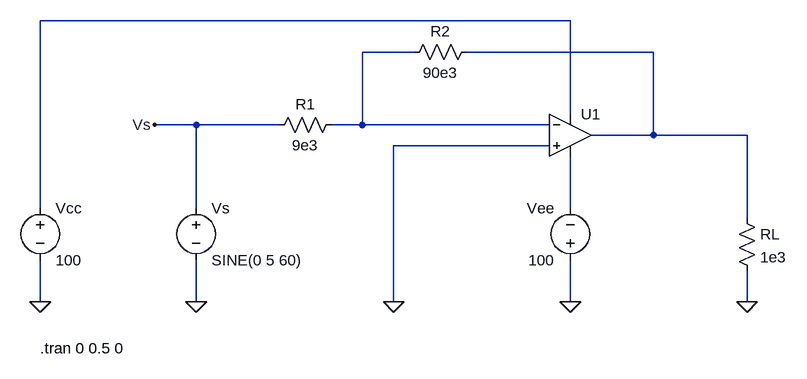
[diagram p0: schematic exercise1.asc]
exercise1.asc, the LTspice schematic file:
Version 4
SHEET 1 1124 680
WIRE 784 -96 -32 -96
WIRE 544 -48 464 -48
WIRE 912 -48 624 -48
WIRE 784 48 784 -96
WIRE 208 64 144 64
WIRE 336 64 208 64
WIRE 464 64 464 -48
WIRE 464 64 416 64
WIRE 752 64 464 64
WIRE 912 80 912 -48
WIRE 912 80 816 80
WIRE 1056 80 912 80
WIRE 752 96 512 96
WIRE -32 192 -32 -96
WIRE 208 192 208 64
WIRE 784 192 784 112
WIRE 1056 208 1056 80
WIRE -32 336 -32 272
WIRE 208 336 208 272
WIRE 512 336 512 96
WIRE 784 336 784 272
WIRE 1056 336 1056 288
FLAG -32 336 0
FLAG 208 336 0
FLAG 784 336 0
FLAG 512 336 0
FLAG 144 64 Vs
FLAG 1056 336 0
SYMBOL voltage 208 176 R0
WINDOW 123 0 0 Left 0
WINDOW 39 0 0 Left 0
SYMATTR InstName Vs
SYMATTR Value SINE(0 5 60)
SYMBOL res 432 48 R90
WINDOW 0 0 56 VBottom 2
WINDOW 3 32 56 VTop 2
SYMATTR InstName R1
SYMATTR Value 9e3
SYMBOL res 640 -64 R90
WINDOW 0 0 56 VBottom 2
WINDOW 3 32 56 VTop 2
SYMATTR InstName R2
SYMATTR Value 90e3
SYMBOL OpAmps\\UniversalOpAmp2 784 80 R0
SYMATTR InstName U1
SYMBOL voltage -32 176 R0
SYMATTR InstName Vcc
SYMATTR Value 100
SYMBOL voltage 784 288 R180
WINDOW 0 24 96 Left 2
WINDOW 3 24 16 Left 2
WINDOW 123 0 0 Left 0
WINDOW 39 0 0 Left 0
SYMATTR InstName Vee
SYMATTR Value 100
SYMBOL res 1040 192 R0
SYMATTR InstName RL
SYMATTR Value 1e3
TEXT -32 408 Left 2 !.tran 0 0.5 0

The netlist it stands for:
* exercise1.asc
Vs Vs 0 SINE(0 5 60)
R1 N002 Vs 9e3
R2 N003 N002 90e3
XU1 0 N002 N001 N004 N003 level2 Avol=1Meg GBW=10Meg Slew=10Meg Ilimit=25m Rail=0 Vos=0 En=0 Enk=0 In=0 Ink=0 Rin=500Meg  ; pins In+ In- V+ V- OUT
Vcc N001 0 100
Vee 0 N004 100
RL N003 0 1e3
.tran 0 0.5 0
.lib UniversalOpAmp2.lib
.backanno
.end